# EAGLE design 8-pin SOIC+TSSOP (EAGLE 6.3)
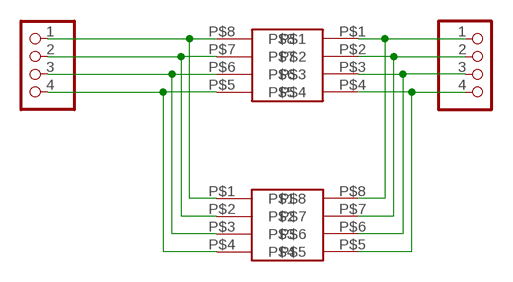
[diagram p0: schematic, sheet 1]

## Parts
CN1  PADS-4  [PADS-4]
CN2  PADS-4  [PADS-4]
U$1  8-PINSOIC-NW  [SO8NW]
U$2  8-PINTSSOP  [TSSOP8]

## Nets
N$7: CN1.1 U$1.P$8 U$2.P$1
N$8: CN2.1 U$1.P$1 U$2.P$8
N$9: CN2.2 U$1.P$2 U$2.P$7
N$10: CN2.3 U$1.P$3 U$2.P$6
N$11: CN2.4 U$1.P$4 U$2.P$5
N$12: CN1.2 U$1.P$7 U$2.P$2
N$13: CN1.3 U$1.P$6 U$2.P$3
N$14: CN1.4 U$1.P$5 U$2.P$4

## Library data of the parts
CN1 CN2 = breakouts:PADS-4: PIN HEADER
U$1 U$2 = breakouts:8-PIN

## Board
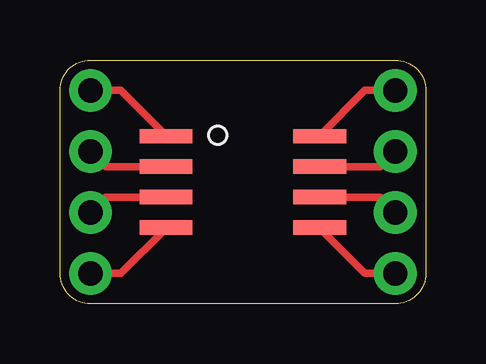
[diagram p1: board, top side]
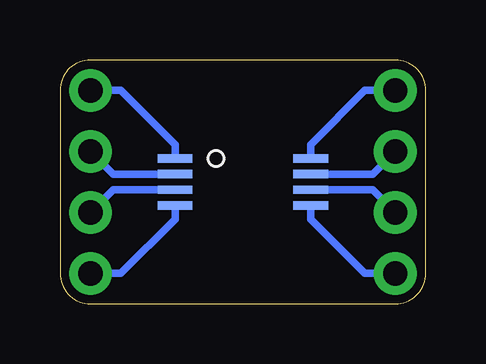
[diagram p2: board, bottom side, seen from below]

Size 15.24 x 10.16 mm. Coordinates in mm from the lower left corner, seen from the top.
Outline: 0,1.27 0,8.89 arc-90 1.27,10.16 13.97,10.16 arc-90 15.24,8.89 15.24,1.27 arc-90 13.97,0 1.27,0 arc-90 0,1.27
Copper layers (1*16): Top 0.035mm / dielectric 1.5mm / Bottom 0.035mm
Design rules: minimum track width 10mil, minimum drill 16mil, track to track 8mil, track to pad 8mil, pad to pad 8mil, via to via 8mil, smd to smd 8mil, copper to edge 10mil, drill to drill 8mil, minimum pad ring 10mil, minimum via ring 8mil, stop-mask expansion 4mil, vias tented up to drill 20mil, thermal gap 10mil

### Footprints (pad centres in the part's own frame; a part is rotated, then mirrored left to right if it is on the bottom)
PADS-4 = drill 1.016 pad 1.778: 1 -3.81,0; 2 -1.27,0; 3 1.27,0; 4 3.81,0
SO8NW = smd 2.2 x 0.6: P$1 -3.2,1.905; P$2 -3.2,0.635; P$3 -3.2,-0.635; P$4 -3.2,-1.905; P$5 3.2,-1.905; P$6 3.2,-0.635; P$7 3.2,0.635; P$8 3.2,1.905
TSSOP8 = smd 1.45 x 0.35: P$1 -2.825,0.975; P$2 -2.825,0.325; P$3 -2.825,-0.325; P$4 -2.825,-0.975; P$5 2.825,-0.975; P$6 2.825,-0.325; P$7 2.825,0.325; P$8 2.825,0.975

### Placement (x,y rotation side)
CN1  13.97,5.08 270 top
CN2  1.27,5.08 270 top
U$1  7.62,5.08 0 top
U$2  7.62,5.08 0 bottom

### Tracks (layer width: path | path; a pad name or v marks a point on that pad's centre or on a via)
N$7
  Top 0.305: U$1.P$8 10.82,7.01 12.7,8.89 CN1.1
  Bottom 0.305: U$2.P$1 10.45,6.63 12.7,8.89 CN1.1
N$8
  Top 0.305: U$1.P$1 4.42,7.01 2.54,8.89 CN2.1
  Bottom 0.305: U$2.P$8 4.79,6.63 2.54,8.89 CN2.1
N$9
  Top 0.305: U$1.P$2 1.91,5.71 CN2.2
  Bottom 0.305: U$2.P$7 2.21,5.41 CN2.2
N$10
  Top 0.305: U$1.P$3 1.91,4.45 CN2.3
  Bottom 0.305: U$2.P$6 2.21,4.75 CN2.3
N$11
  Top 0.305: U$1.P$4 4.42,3.15 2.54,1.27 CN2.4
  Bottom 0.305: U$2.P$5 4.79,3.52 2.54,1.27 CN2.4
N$12
  Top 0.305: U$1.P$7 13.34,5.71 CN1.2
  Bottom 0.305: U$2.P$2 13.03,5.41 CN1.2
N$13
  Top 0.305: U$1.P$6 13.34,4.45 CN1.3
  Bottom 0.305: U$2.P$3 13.03,4.75 CN1.3
N$14
  Top 0.305: U$1.P$5 10.82,3.15 12.7,1.27 CN1.4
  Bottom 0.305: U$2.P$4 10.45,3.52 12.7,1.27 CN1.4

### Text on the board
tValues: SOIC-8
bValues: TSSOP-8